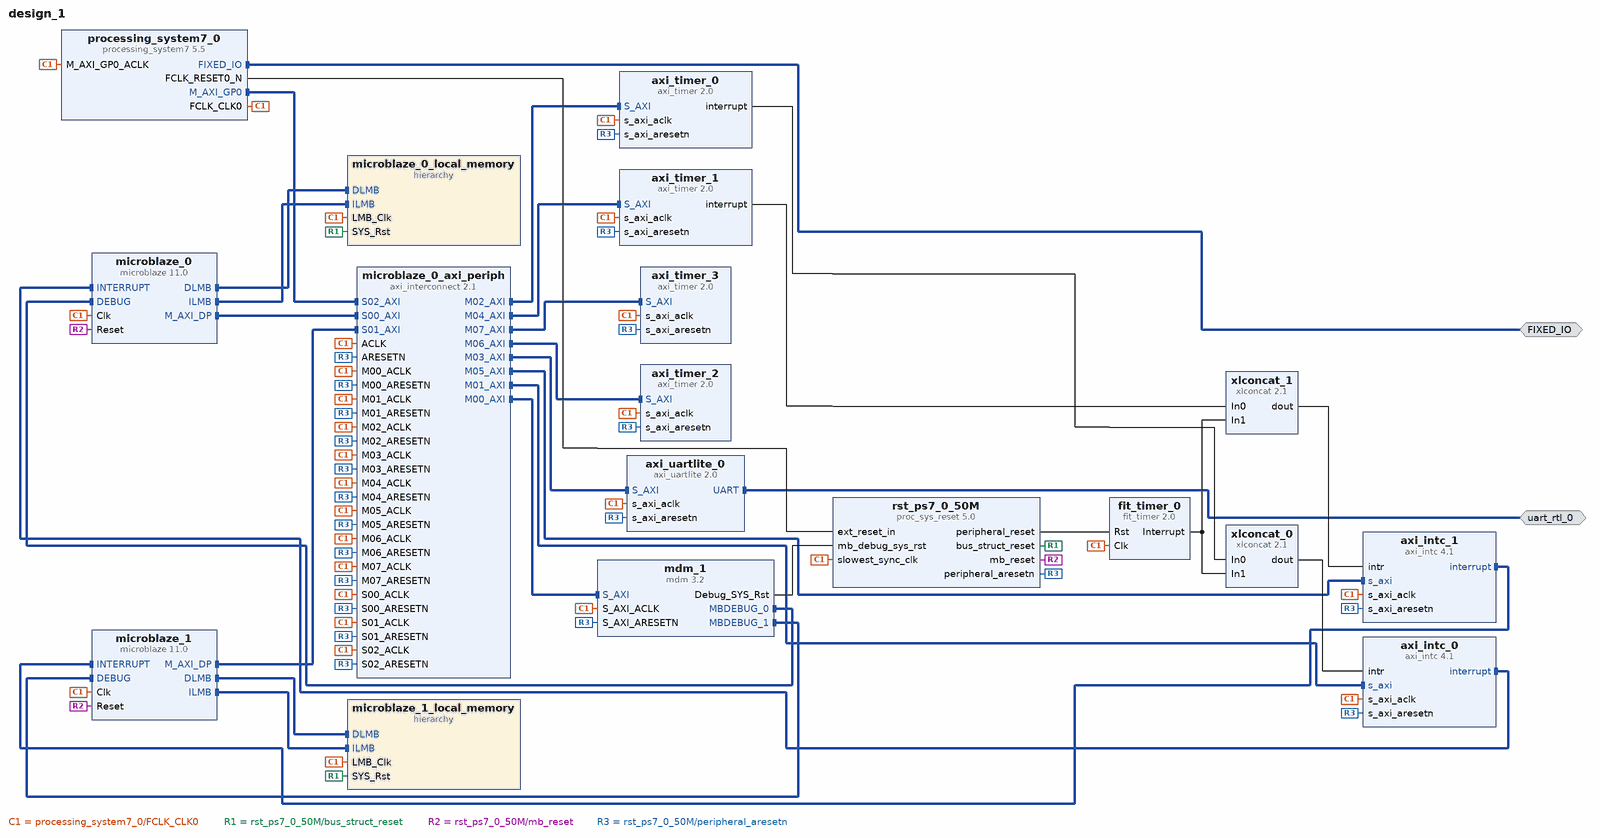
[diagram p0: block diagram of the top level]
# Vivado block design design_1, xc7z020clg400-1, Vivado 2021.1
create_bd_design design_1

create_bd_intf_port -mode Master -vlnv xilinx.com:display_processing_system7:fixedio_rtl:1.0 FIXED_IO
create_bd_intf_port -mode Master -vlnv xilinx.com:interface:uart_rtl:1.0 uart_rtl_0

create_bd_cell -type ip -vlnv xilinx.com:ip:processing_system7:5.5 processing_system7_0
set_property -dict {CONFIG.PCW_UIPARAM_DDR_ENABLE 0} [get_bd_cells processing_system7_0]
# 30 more settings of processing_system7_0 are not shown: defaults, MIO pin electricals, DDR timing, and values the tool derives
create_bd_cell -type ip -vlnv xilinx.com:ip:microblaze:11.0 microblaze_0
set_property -dict [list \
  CONFIG.C_ADDR_TAG_BITS 0 \
  CONFIG.C_DCACHE_ADDR_TAG 0 \
  CONFIG.C_DEBUG_ENABLED 1 \
  CONFIG.C_D_AXI 1 \
  CONFIG.C_D_LMB 1 \
  CONFIG.C_I_LMB 1 \
  CONFIG.C_USE_DCACHE 0 \
  CONFIG.C_USE_ICACHE 0 \
  CONFIG.C_USE_MSR_INSTR 1 \
  CONFIG.C_USE_PCMP_INSTR 1 \
  CONFIG.G_USE_EXCEPTIONS 1 \
] [get_bd_cells microblaze_0]
create_bd_cell -type ip -vlnv xilinx.com:ip:microblaze:11.0 microblaze_1
set_property -dict [list \
  CONFIG.C_ADDR_TAG_BITS 0 \
  CONFIG.C_DCACHE_ADDR_TAG 0 \
  CONFIG.C_DEBUG_ENABLED 1 \
  CONFIG.C_D_AXI 1 \
  CONFIG.C_D_LMB 1 \
  CONFIG.C_I_LMB 1 \
  CONFIG.C_USE_DCACHE 0 \
  CONFIG.C_USE_DIV 0 \
  CONFIG.C_USE_ICACHE 0 \
  CONFIG.C_USE_MSR_INSTR 1 \
  CONFIG.C_USE_PCMP_INSTR 1 \
  CONFIG.G_USE_EXCEPTIONS 0 \
] [get_bd_cells microblaze_1]
create_bd_cell -type hier microblaze_0_local_memory
create_bd_cell -type ip -vlnv xilinx.com:ip:mdm:3.2 mdm_1
set_property -dict [list \
  CONFIG.C_ADDR_SIZE 32 \
  CONFIG.C_MB_DBG_PORTS 2 \
  CONFIG.C_M_AXI_ADDR_WIDTH 32 \
  CONFIG.C_USE_UART 1 \
] [get_bd_cells mdm_1]
create_bd_cell -type ip -vlnv xilinx.com:ip:proc_sys_reset:5.0 rst_ps7_0_50M
create_bd_cell -type hier microblaze_1_local_memory
create_bd_cell -type ip -vlnv xilinx.com:ip:axi_interconnect:2.1 microblaze_0_axi_periph
set_property -dict [list \
  CONFIG.ENABLE_ADVANCED_OPTIONS 1 \
  CONFIG.NUM_MI 8 \
  CONFIG.NUM_SI 3 \
  CONFIG.S00_HAS_DATA_FIFO 2 \
  CONFIG.S01_HAS_DATA_FIFO 2 \
  CONFIG.S02_HAS_DATA_FIFO 2 \
  CONFIG.STRATEGY 2 \
] [get_bd_cells microblaze_0_axi_periph]
create_bd_cell -type ip -vlnv xilinx.com:ip:axi_timer:2.0 axi_timer_0
create_bd_cell -type ip -vlnv xilinx.com:ip:axi_uartlite:2.0 axi_uartlite_0
set_property -dict {CONFIG.C_BAUDRATE 4800} [get_bd_cells axi_uartlite_0]
create_bd_cell -type ip -vlnv xilinx.com:ip:axi_timer:2.0 axi_timer_1
create_bd_cell -type ip -vlnv xilinx.com:ip:axi_intc:4.1 axi_intc_0
create_bd_cell -type ip -vlnv xilinx.com:ip:axi_intc:4.1 axi_intc_1
create_bd_cell -type ip -vlnv xilinx.com:ip:axi_timer:2.0 axi_timer_2
create_bd_cell -type ip -vlnv xilinx.com:ip:axi_timer:2.0 axi_timer_3
create_bd_cell -type ip -vlnv xilinx.com:ip:fit_timer:2.0 fit_timer_0
set_property -dict {CONFIG.C_NO_CLOCKS 500000000} [get_bd_cells fit_timer_0]
create_bd_cell -type ip -vlnv xilinx.com:ip:xlconcat:2.1 xlconcat_0
create_bd_cell -type ip -vlnv xilinx.com:ip:xlconcat:2.1 xlconcat_1

# ---- hierarchy /microblaze_0_local_memory ----
current_bd_instance /microblaze_0_local_memory
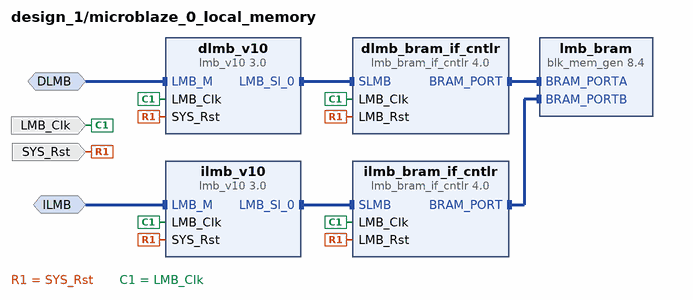
[diagram p1: block diagram inside /microblaze_0_local_memory]
create_bd_intf_pin -mode MirroredMaster -vlnv xilinx.com:interface:lmb_rtl:1.0 DLMB
create_bd_intf_pin -mode MirroredMaster -vlnv xilinx.com:interface:lmb_rtl:1.0 ILMB
create_bd_pin -dir I -type clk LMB_Clk
create_bd_pin -dir I -type rst SYS_Rst

create_bd_cell -type ip -vlnv xilinx.com:ip:lmb_v10:3.0 dlmb_v10
create_bd_cell -type ip -vlnv xilinx.com:ip:lmb_v10:3.0 ilmb_v10
create_bd_cell -type ip -vlnv xilinx.com:ip:lmb_bram_if_cntlr:4.0 dlmb_bram_if_cntlr
set_property -dict {CONFIG.C_ECC 0} [get_bd_cells dlmb_bram_if_cntlr]
create_bd_cell -type ip -vlnv xilinx.com:ip:lmb_bram_if_cntlr:4.0 ilmb_bram_if_cntlr
set_property -dict {CONFIG.C_ECC 0} [get_bd_cells ilmb_bram_if_cntlr]
create_bd_cell -type ip -vlnv xilinx.com:ip:blk_mem_gen:8.4 lmb_bram
set_property -dict {CONFIG.Memory_Type True_Dual_Port_RAM CONFIG.use_bram_block BRAM_Controller} [get_bd_cells lmb_bram]

# ---- hierarchy /microblaze_1_local_memory ----
current_bd_instance /microblaze_1_local_memory
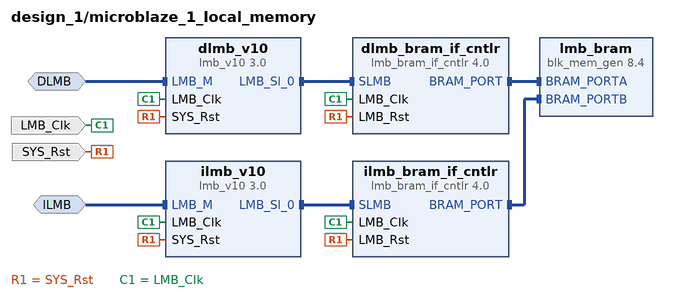
[diagram p2: block diagram inside /microblaze_1_local_memory]
create_bd_intf_pin -mode MirroredMaster -vlnv xilinx.com:interface:lmb_rtl:1.0 DLMB
create_bd_intf_pin -mode MirroredMaster -vlnv xilinx.com:interface:lmb_rtl:1.0 ILMB
create_bd_pin -dir I -type clk LMB_Clk
create_bd_pin -dir I -type rst SYS_Rst

create_bd_cell -type ip -vlnv xilinx.com:ip:lmb_v10:3.0 dlmb_v10
create_bd_cell -type ip -vlnv xilinx.com:ip:lmb_v10:3.0 ilmb_v10
create_bd_cell -type ip -vlnv xilinx.com:ip:lmb_bram_if_cntlr:4.0 dlmb_bram_if_cntlr
set_property -dict {CONFIG.C_ECC 0} [get_bd_cells dlmb_bram_if_cntlr]
create_bd_cell -type ip -vlnv xilinx.com:ip:lmb_bram_if_cntlr:4.0 ilmb_bram_if_cntlr
set_property -dict {CONFIG.C_ECC 0} [get_bd_cells ilmb_bram_if_cntlr]
create_bd_cell -type ip -vlnv xilinx.com:ip:blk_mem_gen:8.4 lmb_bram
set_property -dict {CONFIG.Memory_Type True_Dual_Port_RAM CONFIG.use_bram_block BRAM_Controller} [get_bd_cells lmb_bram]

# ---- connections ----

current_bd_instance /microblaze_0_local_memory
connect_bd_intf_net [get_bd_intf_pins DLMB] [get_bd_intf_pins dlmb_v10/LMB_M]
connect_bd_intf_net [get_bd_intf_pins dlmb_v10/LMB_Sl_0] [get_bd_intf_pins dlmb_bram_if_cntlr/SLMB]
connect_bd_intf_net [get_bd_intf_pins dlmb_bram_if_cntlr/BRAM_PORT] [get_bd_intf_pins lmb_bram/BRAM_PORTA]
connect_bd_intf_net [get_bd_intf_pins ILMB] [get_bd_intf_pins ilmb_v10/LMB_M]
connect_bd_intf_net [get_bd_intf_pins ilmb_v10/LMB_Sl_0] [get_bd_intf_pins ilmb_bram_if_cntlr/SLMB]
connect_bd_intf_net [get_bd_intf_pins ilmb_bram_if_cntlr/BRAM_PORT] [get_bd_intf_pins lmb_bram/BRAM_PORTB]
connect_bd_net [get_bd_pins SYS_Rst] \
  [get_bd_pins dlmb_v10/SYS_Rst] [get_bd_pins dlmb_bram_if_cntlr/LMB_Rst] [get_bd_pins ilmb_v10/SYS_Rst] \
  [get_bd_pins ilmb_bram_if_cntlr/LMB_Rst]
connect_bd_net -net microblaze_0_Clk [get_bd_pins LMB_Clk] \
  [get_bd_pins dlmb_v10/LMB_Clk] [get_bd_pins dlmb_bram_if_cntlr/LMB_Clk] [get_bd_pins ilmb_v10/LMB_Clk] \
  [get_bd_pins ilmb_bram_if_cntlr/LMB_Clk]
set_property HDL_ATTRIBUTE.BMM_INFO_ADDRESS_SPACE {byte  0x00000000 32 > design_1 microblaze_0_local_memory/lmb_bram} [get_bd_cells dlmb_bram_if_cntlr]
set_property HDL_ATTRIBUTE.KEEP_HIERARCHY yes [get_bd_cells dlmb_bram_if_cntlr]

current_bd_instance /microblaze_1_local_memory
connect_bd_intf_net [get_bd_intf_pins DLMB] [get_bd_intf_pins dlmb_v10/LMB_M]
connect_bd_intf_net [get_bd_intf_pins dlmb_v10/LMB_Sl_0] [get_bd_intf_pins dlmb_bram_if_cntlr/SLMB]
connect_bd_intf_net [get_bd_intf_pins dlmb_bram_if_cntlr/BRAM_PORT] [get_bd_intf_pins lmb_bram/BRAM_PORTA]
connect_bd_intf_net [get_bd_intf_pins ILMB] [get_bd_intf_pins ilmb_v10/LMB_M]
connect_bd_intf_net [get_bd_intf_pins ilmb_v10/LMB_Sl_0] [get_bd_intf_pins ilmb_bram_if_cntlr/SLMB]
connect_bd_intf_net [get_bd_intf_pins ilmb_bram_if_cntlr/BRAM_PORT] [get_bd_intf_pins lmb_bram/BRAM_PORTB]
connect_bd_net [get_bd_pins SYS_Rst] \
  [get_bd_pins dlmb_v10/SYS_Rst] [get_bd_pins dlmb_bram_if_cntlr/LMB_Rst] [get_bd_pins ilmb_v10/SYS_Rst] \
  [get_bd_pins ilmb_bram_if_cntlr/LMB_Rst]
connect_bd_net -net microblaze_1_Clk [get_bd_pins LMB_Clk] \
  [get_bd_pins dlmb_v10/LMB_Clk] [get_bd_pins dlmb_bram_if_cntlr/LMB_Clk] [get_bd_pins ilmb_v10/LMB_Clk] \
  [get_bd_pins ilmb_bram_if_cntlr/LMB_Clk]
set_property HDL_ATTRIBUTE.BMM_INFO_ADDRESS_SPACE {byte  0x00000000 32 > design_1 microblaze_1_local_memory/lmb_bram} [get_bd_cells dlmb_bram_if_cntlr]
set_property HDL_ATTRIBUTE.KEEP_HIERARCHY yes [get_bd_cells dlmb_bram_if_cntlr]

current_bd_instance /
connect_bd_intf_net [get_bd_intf_pins axi_intc_0/interrupt] [get_bd_intf_pins microblaze_0/INTERRUPT]
connect_bd_intf_net [get_bd_intf_pins axi_intc_1/interrupt] [get_bd_intf_pins microblaze_1/INTERRUPT]
connect_bd_intf_net [get_bd_intf_ports uart_rtl_0] [get_bd_intf_pins axi_uartlite_0/UART]
connect_bd_intf_net [get_bd_intf_pins microblaze_0/M_AXI_DP] [get_bd_intf_pins microblaze_0_axi_periph/S00_AXI]
connect_bd_intf_net [get_bd_intf_pins microblaze_0_axi_periph/M00_AXI] [get_bd_intf_pins mdm_1/S_AXI]
connect_bd_intf_net [get_bd_intf_pins microblaze_0_axi_periph/M01_AXI] [get_bd_intf_pins axi_intc_0/s_axi]
connect_bd_intf_net [get_bd_intf_pins microblaze_0_axi_periph/M02_AXI] [get_bd_intf_pins axi_timer_0/S_AXI]
connect_bd_intf_net [get_bd_intf_pins microblaze_0_axi_periph/M03_AXI] [get_bd_intf_pins axi_uartlite_0/S_AXI]
connect_bd_intf_net [get_bd_intf_pins microblaze_0_axi_periph/M04_AXI] [get_bd_intf_pins axi_timer_1/S_AXI]
connect_bd_intf_net [get_bd_intf_pins microblaze_0_axi_periph/M05_AXI] [get_bd_intf_pins axi_intc_1/s_axi]
connect_bd_intf_net [get_bd_intf_pins microblaze_0_axi_periph/M06_AXI] [get_bd_intf_pins axi_timer_2/S_AXI]
connect_bd_intf_net [get_bd_intf_pins microblaze_0_axi_periph/M07_AXI] [get_bd_intf_pins axi_timer_3/S_AXI]
connect_bd_intf_net [get_bd_intf_pins mdm_1/MBDEBUG_0] [get_bd_intf_pins microblaze_0/DEBUG]
connect_bd_intf_net [get_bd_intf_pins microblaze_0/DLMB] [get_bd_intf_pins microblaze_0_local_memory/DLMB]
connect_bd_intf_net [get_bd_intf_pins microblaze_0/ILMB] [get_bd_intf_pins microblaze_0_local_memory/ILMB]
connect_bd_intf_net [get_bd_intf_pins microblaze_1/M_AXI_DP] [get_bd_intf_pins microblaze_0_axi_periph/S01_AXI]
connect_bd_intf_net [get_bd_intf_pins mdm_1/MBDEBUG_1] [get_bd_intf_pins microblaze_1/DEBUG]
connect_bd_intf_net [get_bd_intf_pins microblaze_1/DLMB] [get_bd_intf_pins microblaze_1_local_memory/DLMB]
connect_bd_intf_net [get_bd_intf_pins microblaze_1/ILMB] [get_bd_intf_pins microblaze_1_local_memory/ILMB]
connect_bd_intf_net [get_bd_intf_ports FIXED_IO] [get_bd_intf_pins processing_system7_0/FIXED_IO]
connect_bd_intf_net [get_bd_intf_pins processing_system7_0/M_AXI_GP0] [get_bd_intf_pins microblaze_0_axi_periph/S02_AXI]
connect_bd_net [get_bd_pins axi_timer_0/interrupt] [get_bd_pins xlconcat_0/In0]
connect_bd_net [get_bd_pins axi_timer_1/interrupt] [get_bd_pins xlconcat_1/In0]
connect_bd_net [get_bd_pins fit_timer_0/Interrupt] [get_bd_pins xlconcat_0/In1] [get_bd_pins xlconcat_1/In1]
connect_bd_net [get_bd_pins mdm_1/Debug_SYS_Rst] [get_bd_pins rst_ps7_0_50M/mb_debug_sys_rst]
connect_bd_net -net microblaze_1_Clk [get_bd_pins processing_system7_0/FCLK_CLK0] \
  [get_bd_pins microblaze_0/Clk] [get_bd_pins microblaze_0_local_memory/LMB_Clk] [get_bd_pins rst_ps7_0_50M/slowest_sync_clk] \
  [get_bd_pins microblaze_1/Clk] [get_bd_pins microblaze_1_local_memory/LMB_Clk] [get_bd_pins mdm_1/S_AXI_ACLK] \
  [get_bd_pins processing_system7_0/M_AXI_GP0_ACLK] [get_bd_pins microblaze_0_axi_periph/ACLK] \
  [get_bd_pins microblaze_0_axi_periph/S00_ACLK] [get_bd_pins microblaze_0_axi_periph/M00_ACLK] \
  [get_bd_pins microblaze_0_axi_periph/S01_ACLK] [get_bd_pins microblaze_0_axi_periph/S02_ACLK] \
  [get_bd_pins microblaze_0_axi_periph/M01_ACLK] [get_bd_pins axi_timer_0/s_axi_aclk] \
  [get_bd_pins microblaze_0_axi_periph/M02_ACLK] [get_bd_pins microblaze_0_axi_periph/M03_ACLK] \
  [get_bd_pins axi_uartlite_0/s_axi_aclk] [get_bd_pins axi_timer_1/s_axi_aclk] [get_bd_pins microblaze_0_axi_periph/M04_ACLK] \
  [get_bd_pins axi_intc_0/s_axi_aclk] [get_bd_pins axi_intc_1/s_axi_aclk] [get_bd_pins microblaze_0_axi_periph/M05_ACLK] \
  [get_bd_pins axi_timer_2/s_axi_aclk] [get_bd_pins microblaze_0_axi_periph/M06_ACLK] [get_bd_pins axi_timer_3/s_axi_aclk] \
  [get_bd_pins microblaze_0_axi_periph/M07_ACLK] [get_bd_pins fit_timer_0/Clk]
connect_bd_net [get_bd_pins processing_system7_0/FCLK_RESET0_N] [get_bd_pins rst_ps7_0_50M/ext_reset_in]
connect_bd_net [get_bd_pins rst_ps7_0_50M/bus_struct_reset] \
  [get_bd_pins microblaze_0_local_memory/SYS_Rst] [get_bd_pins microblaze_1_local_memory/SYS_Rst]
connect_bd_net [get_bd_pins rst_ps7_0_50M/mb_reset] [get_bd_pins microblaze_0/Reset] [get_bd_pins microblaze_1/Reset]
connect_bd_net [get_bd_pins rst_ps7_0_50M/peripheral_aresetn] \
  [get_bd_pins mdm_1/S_AXI_ARESETN] [get_bd_pins microblaze_0_axi_periph/S00_ARESETN] \
  [get_bd_pins microblaze_0_axi_periph/M00_ARESETN] [get_bd_pins microblaze_0_axi_periph/ARESETN] \
  [get_bd_pins microblaze_0_axi_periph/S01_ARESETN] [get_bd_pins microblaze_0_axi_periph/S02_ARESETN] \
  [get_bd_pins microblaze_0_axi_periph/M01_ARESETN] [get_bd_pins axi_timer_0/s_axi_aresetn] \
  [get_bd_pins microblaze_0_axi_periph/M02_ARESETN] [get_bd_pins microblaze_0_axi_periph/M03_ARESETN] \
  [get_bd_pins axi_uartlite_0/s_axi_aresetn] [get_bd_pins axi_timer_1/s_axi_aresetn] \
  [get_bd_pins microblaze_0_axi_periph/M04_ARESETN] [get_bd_pins axi_intc_0/s_axi_aresetn] \
  [get_bd_pins axi_intc_1/s_axi_aresetn] [get_bd_pins microblaze_0_axi_periph/M05_ARESETN] \
  [get_bd_pins axi_timer_2/s_axi_aresetn] [get_bd_pins microblaze_0_axi_periph/M06_ARESETN] \
  [get_bd_pins axi_timer_3/s_axi_aresetn] [get_bd_pins microblaze_0_axi_periph/M07_ARESETN]
connect_bd_net [get_bd_pins rst_ps7_0_50M/peripheral_reset] [get_bd_pins fit_timer_0/Rst]
connect_bd_net [get_bd_pins xlconcat_0/dout] [get_bd_pins axi_intc_0/intr]
connect_bd_net [get_bd_pins xlconcat_1/dout] [get_bd_pins axi_intc_1/intr]
set_property HDL_ATTRIBUTE.BMM_INFO_PROCESSOR {microblaze-le > design_1 microblaze_0_local_memory/dlmb_bram_if_cntlr} [get_bd_cells microblaze_0]
set_property HDL_ATTRIBUTE.KEEP_HIERARCHY yes [get_bd_cells microblaze_0]
set_property HDL_ATTRIBUTE.BMM_INFO_PROCESSOR {microblaze-le > design_1 microblaze_1_local_memory/dlmb_bram_if_cntlr} [get_bd_cells microblaze_1]
set_property HDL_ATTRIBUTE.KEEP_HIERARCHY yes [get_bd_cells microblaze_1]

# ---- address map ----
assign_bd_address -offset 0x00000000 -range 128K -target_address_space [get_bd_addr_spaces microblaze_0/Data] [get_bd_addr_segs microblaze_0_local_memory/dlmb_bram_if_cntlr/SLMB/Mem]
assign_bd_address -offset 0x41400000 -range 4K -target_address_space [get_bd_addr_spaces microblaze_0/Data] [get_bd_addr_segs mdm_1/S_AXI/Reg]
assign_bd_address -offset 0x41800000 -range 64K -target_address_space [get_bd_addr_spaces microblaze_0/Data] [get_bd_addr_segs axi_intc_0/S_AXI/Reg]
assign_bd_address -offset 0x41810000 -range 64K -target_address_space [get_bd_addr_spaces microblaze_0/Data] [get_bd_addr_segs axi_intc_1/S_AXI/Reg]
assign_bd_address -offset 0x42800000 -range 64K -target_address_space [get_bd_addr_spaces microblaze_0/Data] [get_bd_addr_segs axi_timer_0/S_AXI/Reg]
assign_bd_address -offset 0x42810000 -range 64K -target_address_space [get_bd_addr_spaces microblaze_0/Data] [get_bd_addr_segs axi_timer_1/S_AXI/Reg]
assign_bd_address -offset 0x42820000 -range 64K -target_address_space [get_bd_addr_spaces microblaze_0/Data] [get_bd_addr_segs axi_timer_2/S_AXI/Reg]
assign_bd_address -offset 0x42830000 -range 64K -target_address_space [get_bd_addr_spaces microblaze_0/Data] [get_bd_addr_segs axi_timer_3/S_AXI/Reg]
assign_bd_address -offset 0x42C00000 -range 64K -target_address_space [get_bd_addr_spaces microblaze_0/Data] [get_bd_addr_segs axi_uartlite_0/S_AXI/Reg]
assign_bd_address -offset 0x00000000 -range 128K -target_address_space [get_bd_addr_spaces microblaze_0/Instruction] [get_bd_addr_segs microblaze_0_local_memory/ilmb_bram_if_cntlr/SLMB/Mem]
assign_bd_address -offset 0x00000000 -range 128K -target_address_space [get_bd_addr_spaces microblaze_1/Data] [get_bd_addr_segs microblaze_1_local_memory/dlmb_bram_if_cntlr/SLMB/Mem]
assign_bd_address -offset 0x41400000 -range 4K -target_address_space [get_bd_addr_spaces microblaze_1/Data] [get_bd_addr_segs mdm_1/S_AXI/Reg]
assign_bd_address -offset 0x41800000 -range 64K -target_address_space [get_bd_addr_spaces microblaze_1/Data] [get_bd_addr_segs axi_intc_0/S_AXI/Reg]
assign_bd_address -offset 0x41810000 -range 64K -target_address_space [get_bd_addr_spaces microblaze_1/Data] [get_bd_addr_segs axi_intc_1/S_AXI/Reg]
assign_bd_address -offset 0x42800000 -range 64K -target_address_space [get_bd_addr_spaces microblaze_1/Data] [get_bd_addr_segs axi_timer_0/S_AXI/Reg]
assign_bd_address -offset 0x42810000 -range 64K -target_address_space [get_bd_addr_spaces microblaze_1/Data] [get_bd_addr_segs axi_timer_1/S_AXI/Reg]
assign_bd_address -offset 0x42820000 -range 64K -target_address_space [get_bd_addr_spaces microblaze_1/Data] [get_bd_addr_segs axi_timer_2/S_AXI/Reg]
assign_bd_address -offset 0x42830000 -range 64K -target_address_space [get_bd_addr_spaces microblaze_1/Data] [get_bd_addr_segs axi_timer_3/S_AXI/Reg]
assign_bd_address -offset 0x42C00000 -range 64K -target_address_space [get_bd_addr_spaces microblaze_1/Data] [get_bd_addr_segs axi_uartlite_0/S_AXI/Reg]
assign_bd_address -offset 0x00000000 -range 128K -target_address_space [get_bd_addr_spaces microblaze_1/Instruction] [get_bd_addr_segs microblaze_1_local_memory/ilmb_bram_if_cntlr/SLMB/Mem]
assign_bd_address -offset 0x41400000 -range 4K -target_address_space [get_bd_addr_spaces processing_system7_0/Data] [get_bd_addr_segs mdm_1/S_AXI/Reg]
assign_bd_address -offset 0x41800000 -range 64K -target_address_space [get_bd_addr_spaces processing_system7_0/Data] [get_bd_addr_segs axi_intc_0/S_AXI/Reg]
assign_bd_address -offset 0x41810000 -range 64K -target_address_space [get_bd_addr_spaces processing_system7_0/Data] [get_bd_addr_segs axi_intc_1/S_AXI/Reg]
assign_bd_address -offset 0x42800000 -range 64K -target_address_space [get_bd_addr_spaces processing_system7_0/Data] [get_bd_addr_segs axi_timer_0/S_AXI/Reg]
assign_bd_address -offset 0x42810000 -range 64K -target_address_space [get_bd_addr_spaces processing_system7_0/Data] [get_bd_addr_segs axi_timer_1/S_AXI/Reg]
assign_bd_address -offset 0x42820000 -range 64K -target_address_space [get_bd_addr_spaces processing_system7_0/Data] [get_bd_addr_segs axi_timer_2/S_AXI/Reg]
assign_bd_address -offset 0x42830000 -range 64K -target_address_space [get_bd_addr_spaces processing_system7_0/Data] [get_bd_addr_segs axi_timer_3/S_AXI/Reg]
assign_bd_address -offset 0x42C00000 -range 64K -target_address_space [get_bd_addr_spaces processing_system7_0/Data] [get_bd_addr_segs axi_uartlite_0/S_AXI/Reg]

validate_bd_design
save_bd_design
